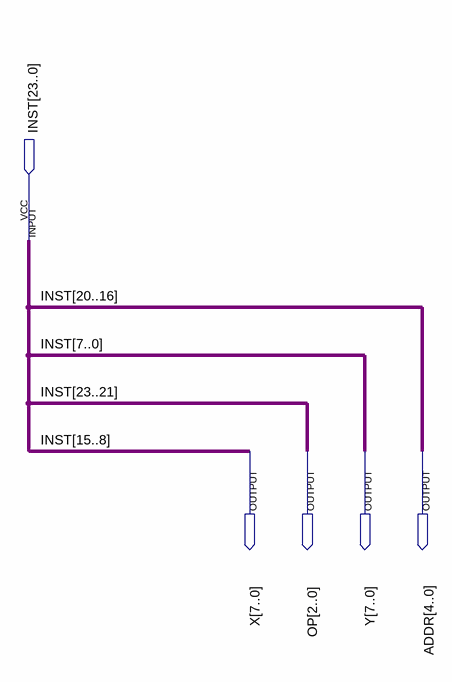
[diagram p0: schematic sheet]
// Quartus schematic Decoder.bdf as structural Verilog: 0 symbols, 5 pins
module Decoder (
  input  [23:0] INST,
  output [7:0] X,
  output [2:0] OP,
  output [7:0] Y,
  output [4:0] ADDR
);


  assign ADDR = INST[20:16];
  assign OP = INST[23:21];
  assign X = INST[15:8];
  assign Y = INST[7:0];
endmodule
